# EAGLE design ROG_Condor (EAGLE 7.7.0)
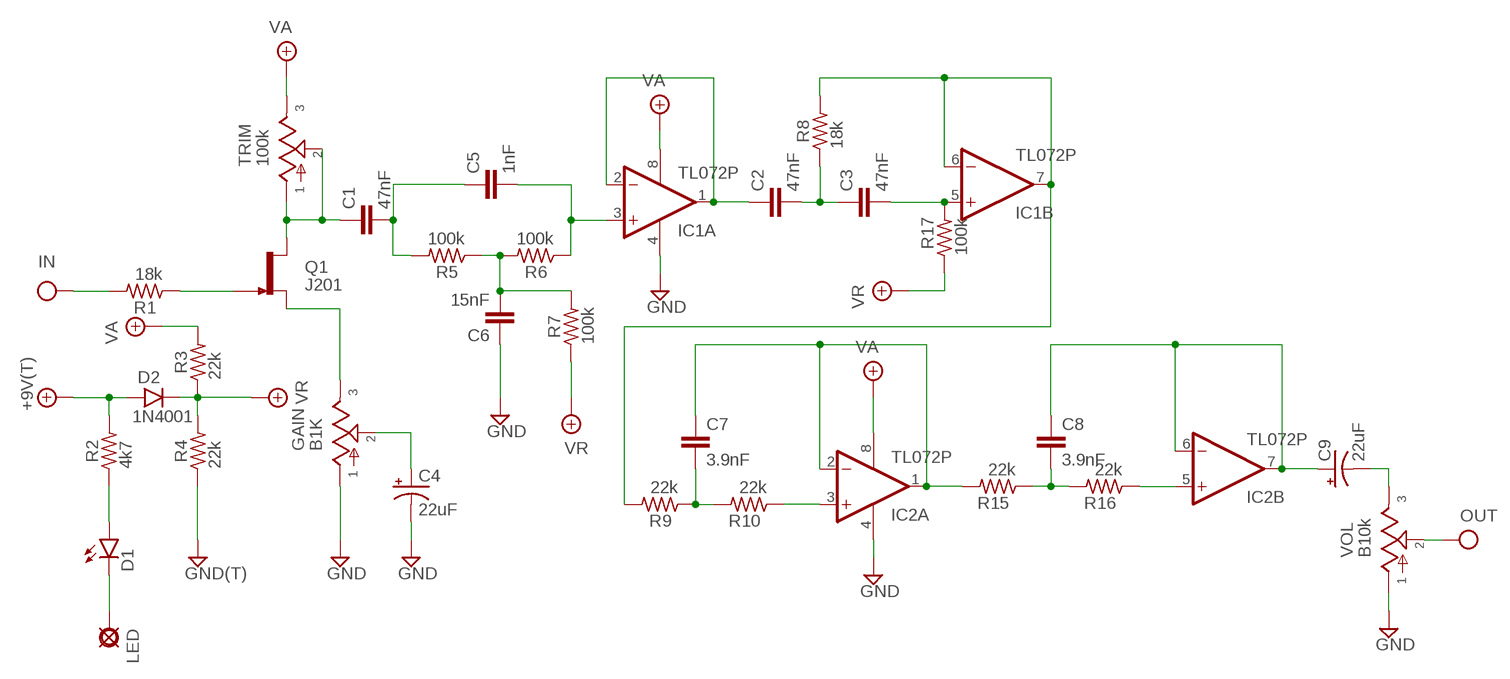
[diagram p0: schematic, sheet 1]

## Parts
+9V  +9V(T)  [SQUARE]
C1  47nF  075X0402  [075X040]
C2  47nF  075X0402  [075X040]
C3  47nF  075X0402  [075X040]
C4  22uF  0501  [050_020_1]
C5  1nF  075X0402  [075X040]
C6  15nF  075X0402  [075X040]
C7  3.9nF  075X0402  [075X040]
C8  3.9nF  075X0402  [075X040]
C9  22uF  0501  [050_020_1]
D1  LED3MM  [LED3MM]
D2  1N4001  1N400X.3  [DO41-3]
GAIN  B1K  POT16MM  [16MM]
GND  GND(T)  [SQUARE]
IC1  TL072P  [DIL08]
IC2  TL072P  [DIL08]
IN  IN(T)  [SQUARE]
LED  LED  PAD  [SQUARE]
OUT  OUT(T)  [SQUARE]
Q1  J201  [TO92-]
R1  18k  6MM.3  [R0207/3]
R2  4k7  6MM.3  [R0207/3]
R3  22k  6MM.3  [R0207/3]
R4  22k  6MM.3  [R0207/3]
R5  100k  6MM.3  [R0207/3]
R6  100k  6MM.3  [R0207/3]
R7  100k  6MM.3  [R0207/3]
R8  18k  6MM.3  [R0207/3]
R9  22k  6MM.3  [R0207/3]
R10  22k  6MM.3  [R0207/3]
R15  22k  6MM.3  [R0207/3]
R16  22k  6MM.3  [R0207/3]
R17  100k  6MM.3  [R0207/3]
TRIM  100k  POTTRIM  [B25P]
VOL  B10k  POT16MM  [16MM]

## Nets
+9V: +9V.1(+9V) D2.A R2.2
GND: C4.- C6.1 GAIN.1 GND.1(GND) IC1.4(P:V-) IC2.4(P:V-) R4.1 VOL.1
IN: IN.1(IN) R1.2
N$1: C7.2 R9.1 R10.2
N$2: IC2.3(A:+IN) R10.1
N$3: Q1.1(G) R1.1
N$4: C1.1 Q1.3(D) TRIM.1 TRIM.2
N$5: D1.A R2.1
N$6: D1.K(C) LED.1(PAD)
N$7: C4.+ GAIN.2
N$8: GAIN.3 Q1.2(S)
N$10: C1.2 C5.1 R5.2
N$11: C5.2 IC1.3(A:+IN) R6.1
N$12: C2.1 IC1.1(A:OUT) IC1.2(A:-IN)
N$13: C6.2 R5.1 R6.2 R7.2
N$14: C2.2 C3.1 R8.1
N$15: C3.2 IC1.5(B:+IN) R17.2
N$16: IC1.6(B:-IN) IC1.7(B:OUT) R8.2 R9.2
N$17: C7.1 IC2.1(A:OUT) IC2.2(A:-IN) R15.2
N$18: C8.2 R15.1 R16.2
N$19: IC2.5(B:+IN) R16.1
N$20: C8.1 C9.+ IC2.6(B:-IN) IC2.7(B:OUT)
N$21: C9.- VOL.3
OUT: OUT.1(OUT) VOL.2
VA: IC1.8(P:V+) IC2.8(P:V+) R3.2 TRIM.3
VR: D2.C R3.1 R4.2 R7.1 R17.1

## Library data of the parts
+9V = mb_supply:+9V(T): +9V Voltage Supply use this to hook up +9v throughout a schematic instead of running wire automatically labels the net "+9v" adds a hookup pad to the circuit board
C1-C3 C5-C8 = mb_caps-chicklet:075X040: 0.039 - 0.047uF Panasonic ECQ-B 7mm x 4mm 50V: 0.039 - 0.047uF;
C4 C9 = mb_caps-electro:050: 0.22 - 100uF Xicon values at Mouser.com: 10V: 10 - 100uF; 16V: 2.2 - 47uF; 25V: 0.47 - 47uF; 50V: 0.22 - 22uF
D1 = mb_diodes:LED
D2 = mb_diodes:1N400X: Rectifier Diodes often used in power supply to prevent damage from reverse polarization
GAIN TRIM VOL = mb_pots:POT: Potentiometers the arrow indicates the clockwise motion of th wiper (lug 2) fully counter clockwise there is no resistance between lugs 1 and 2 fully clockwise the resistance between lugs 1 and 2 is the value of the pot
GND = mb_supply:GND(T): Ground use this to hook up ground (GND) throughout a schematic instead of running wire automatically labels the net "GND" adds a hookup pad to the circuit board (you can use several)
IC1 IC2 = mb_ics:TL072: OP AMP
IN = mb_supply:IN(T): Input obsolete: use Pad instead and label net shematic input label with circuit board terminal/pad generally used only once on a schematic (because this device labels the net "IN" in the same way as a voltage supply or ground net)
LED = mb_supply:PAD: PAD use this package for pads with any purpose, including input, output, send or return various pad shapes: round, square, octogonal, long, and long offset
OUT = mb_supply:OUT(T): Output obsolete: use Pad instead and label net output label with circuit board terminal/pad usually appears only once on a schematic
Q1 = mb_trans:J201: N-channel JFET
R1-R10 R15-R17 = mb_resistors:6MM: 6mm Resistors Leads spaced 1-6 holes apart for 0.1" perfboard. Suitable for 1/4 watt resistors.

## Board
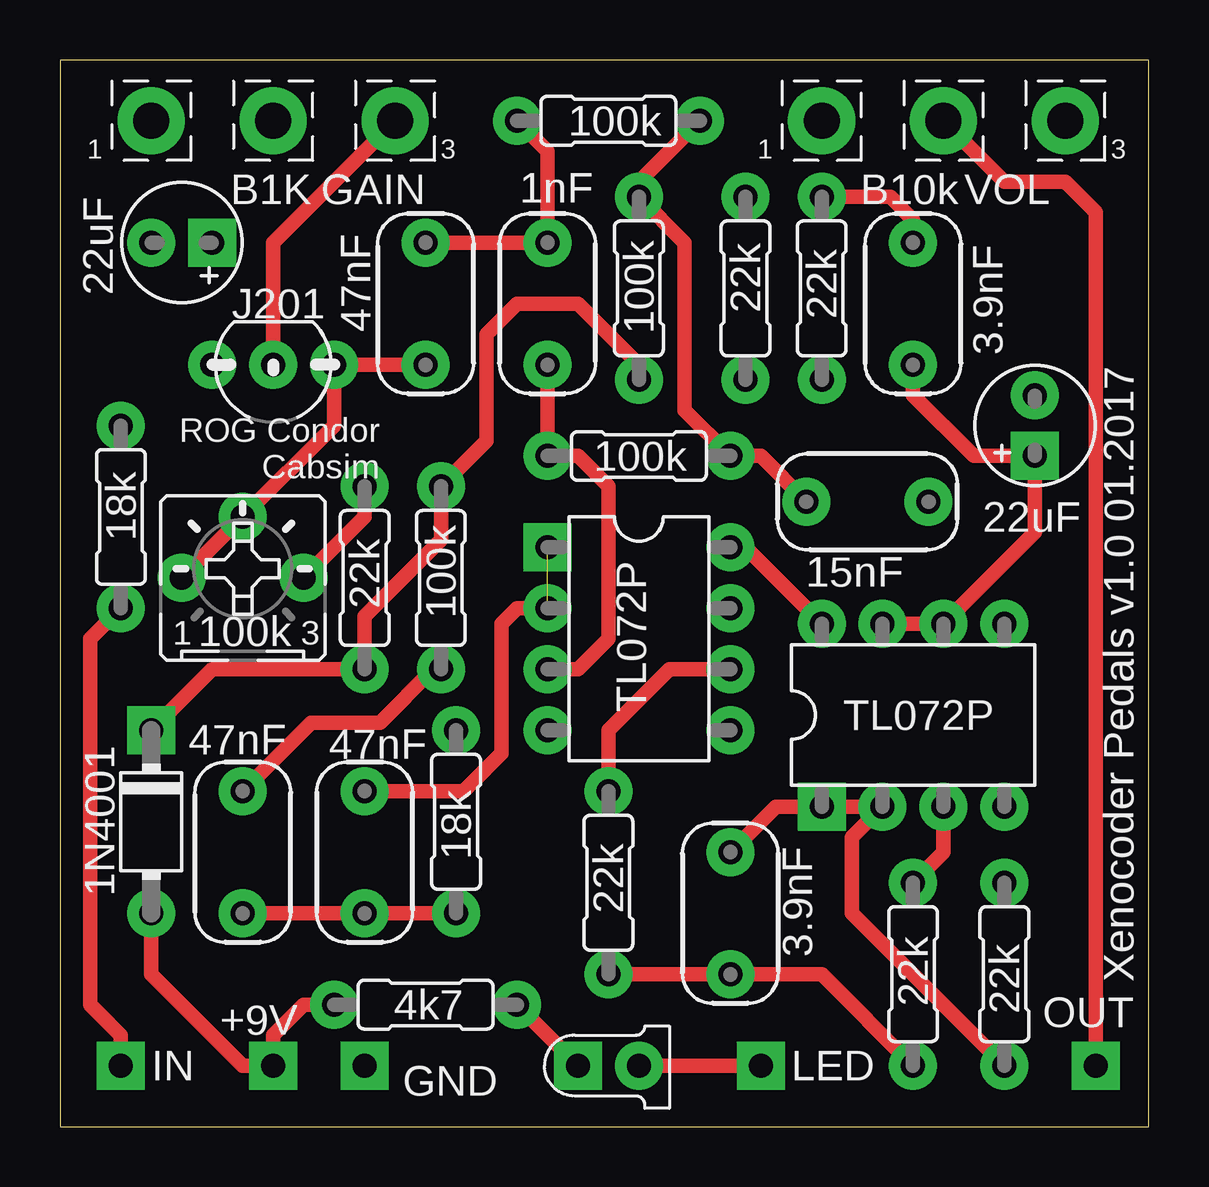
[diagram p1: board, top side]
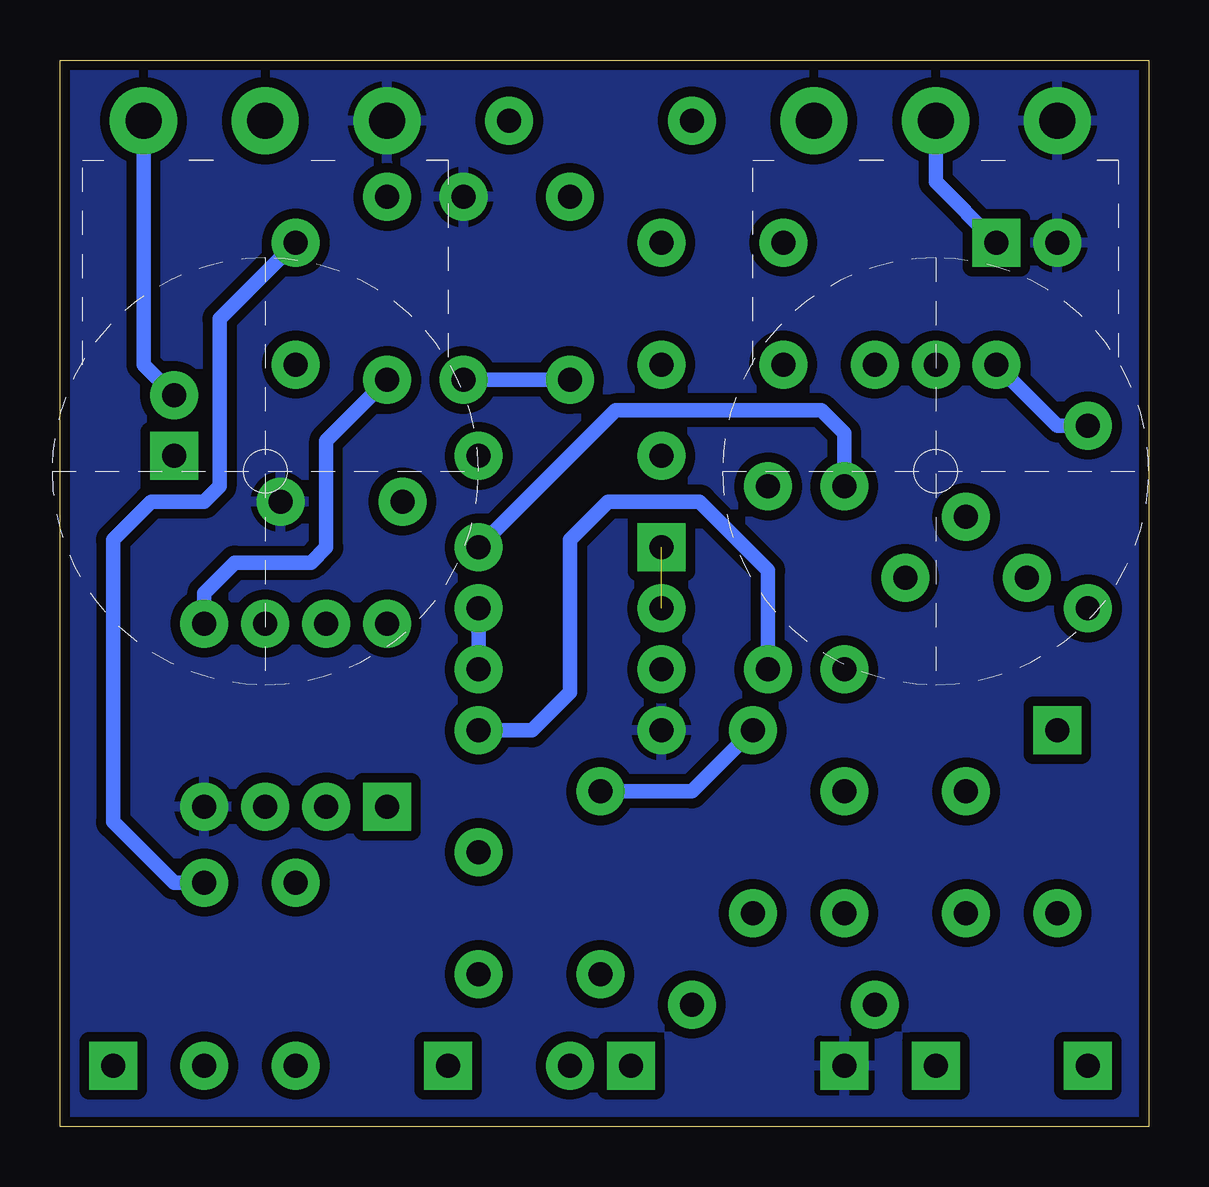
[diagram p2: board, bottom side, seen from below]

Size 45.39 x 44.44 mm. Coordinates in mm from the lower left corner, seen from the top.
Outline: 0,0 45.39,0 45.39,44.44 0,44.44 0,0
Copper layers (1*16): Top 0.0356mm / dielectric 1.5011mm / Bottom 0.0356mm
Design rules "LaenPCBOrder": minimum track width 6mil, minimum drill 13mil, track to track 6mil, track to pad 6mil, pad to pad 6mil, via to via 6mil, smd to smd 6mil, copper to edge 15mil, drill to drill 6mil, minimum pad ring 7mil, minimum via ring 7mil, stop-mask expansion 3mil, vias tented up to drill 0mil, thermal gap 10mil

### Footprints (pad centres in the part's own frame; a part is rotated, then mirrored left to right if it is on the bottom)
SQUARE = drill 1 pad 2 square: 1 0,0
075X040 = drill 1 pad 2: 1 -2.54,0; 2 2.54,0
050_020_1 = drill 1 pad 2 square: + -1.27,0 | drill 1 pad 2: - 1.27,0
LED3MM = drill 1 pad 2 square: A -1.27,0 | drill 1 pad 2: K 1.27,0
DO41-3 = drill 1 pad 2: A 3.81,0 | drill 1 pad 2 square: C -3.81,0
16MM = drill 1.5 pad 2.794: 1 5.08,0; 2 0,0; 3 -5.08,0
DIL08 = drill 1 pad 2 square: 1 -3.81,-3.81 | drill 1 pad 2: 2 -1.27,-3.81; 3 1.27,-3.81; 4 3.81,-3.81; 5 3.81,3.81; 6 1.27,3.81; 7 -1.27,3.81; 8 -3.81,3.81
TO92- = drill 1 pad 2: 1 2.54,0; 2 0,0; 3 -2.54,0
R0207/3 = drill 1 pad 2: 1 -3.81,0; 2 3.81,0
B25P = drill 1 pad 2: 1 -2.54,0; 2 0,2.54; 3 2.54,0

### Placement (x,y rotation side)
+9V  8.89,2.54 0 top
C1  15.24,34.29 90 top
C2  12.7,11.43 270 top
C3  7.62,11.43 90 top
C4  5.08,36.83 180 top
C5  20.32,34.29 270 top
C6  33.66,26.04 180 top
C7  27.94,8.89 270 top
C8  35.56,34.29 90 top
C9  40.64,29.21 90 top
D1  22.86,2.54 0 top
D2  3.81,12.7 270 top
GAIN  8.89,41.91 180 top
GND  12.7,2.54 0 top
IC1  24.13,20.32 270 top
IC2  35.56,17.14 0 top
IN  2.54,2.54 0 top
LED  29.21,2.54 0 top
OUT  43.18,2.54 0 top
Q1  8.89,31.75 180 top
R1  2.54,25.4 270 top
R2  15.24,5.08 180 top
R3  12.7,22.86 90 top
R4  28.57,34.92 270 top
R5  22.86,41.91 180 top
R6  24.13,27.94 0 top
R7  24.13,34.92 90 top
R8  16.51,12.7 90 top
R9  22.86,10.16 90 top
R10  35.56,6.35 270 top
R15  39.37,6.35 270 top
R16  31.75,34.92 90 top
R17  15.88,22.86 270 top
TRIM  7.62,22.86 0 top
VOL  36.83,41.91 180 top

### Tracks (layer width: path | path; a pad name or v marks a point on that pad's centre or on a via)
+9V
  Top 0.61: R2.2 10.16,5.08 8.89,3.81 +9V.1 7.62,2.54 3.81,6.35 D2.A
GND
  pour Bottom (isolate 0.406): 0,44.45 45.72,44.45 45.72,0 0,0
IN
  Top 0.61: R1.2 1.27,20.32 1.27,5.08 2.54,3.81 IN.1
N$1
  Top 0.61: R9.1 C7.2 31.75,6.35 R10.2
N$2
  Top 0.61: R10.1 36.83,11.43 IC2.3
N$3
  Bottom 0.61: R1.1 3.81,29.21 Q1.1
N$4
  Top 0.61: TRIM.1 TRIM.2 11.43,29.21 Q1.3 C1.1
N$5
  Top 0.61: R2.1 D1.A
N$6
  Top 0.61: LED.1 D1.K
N$7
  Bottom 0.61: C4.+ 8.89,39.37 GAIN.2
N$8
  Top 0.61: Q1.2 8.89,36.83 GAIN.3
N$10
  Top 0.61: R5.2 20.32,40.64 C5.1 C1.2
N$11
  Top 0.61: IC1.3 21.59,19.05 22.86,20.32 22.86,26.67 21.59,27.94 R6.1 C5.2
N$12  (1 unrouted)
  Top 0.61: C2.1 16.83,13.97 18.41,15.56 18.41,20.95 19.05,21.59 IC1.2
N$13
  Top 0.61: R5.1 24.13,39.37 R7.2 26.04,36.83 26.04,29.84 R6.2 29.21,27.94 C6.2
N$14
  Top 0.61: C3.1 C2.2 R8.1
N$15
  Top 0.61: C3.2 10.48,16.83 13.34,16.83 15.56,19.05 R17.2
  Bottom 0.61: R17.2 15.88,23.18 18.73,26.04 22.54,26.04 24.13,24.45 24.13,18.1 25.72,16.51 IC1.5
N$16
  Top 0.61: R9.2 22.86,16.51 25.4,19.05 IC1.6
  Bottom 0.61: R8.2 19.05,13.97 R9.2 | IC1.7 IC1.6
N$17
  Top 0.61: C7.1 29.84,13.34 IC2.1 IC2.2 33.02,12.06 33.02,8.89 R15.2
N$18
  Top 0.61: C8.2 35.56,37.78 34.61,38.73 R16.2
  Bottom 0.61: C8.2 38.73,33.66 38.73,26.67 39.37,26.04 41.59,26.04 43.18,24.45 43.18,12.7 40.64,10.16 R15.1
N$19
  Bottom 0.61: IC2.5 39.37,22.23 38.1,23.5 34.92,23.5 34.29,24.13 34.29,28.57 R16.1
N$20
  Top 0.61: C8.1 35.56,30.48 38.1,27.94 C9.+ 40.64,24.77 IC2.6 IC2.7
N$21
  Bottom 0.61: C9.- 41.91,31.75 VOL.3
OUT
  Top 0.61: VOL.2 39.37,39.37 41.91,39.37 43.18,38.1 OUT.1
VA
  Top 0.61: TRIM.3 12.7,25.4 R3.2 | IC2.8 28.57,24.13 IC1.8
  Bottom 0.61: R3.2 12.7,28.89 13.65,29.84 22.23,29.84 IC1.8
VR
  Top 0.61: R7.1 24.13,31.75 21.59,34.29 19.05,34.29 17.78,33.02 17.78,28.57 R17.1 15.88,24.45 12.7,21.27 R3.1 6.35,19.05 D2.C
  Bottom 0.61: R7.1 R4.2

### Text on the board
tNames: ROG Condor / Cabsim | Xenocoder Pedals v1.0 01.2017